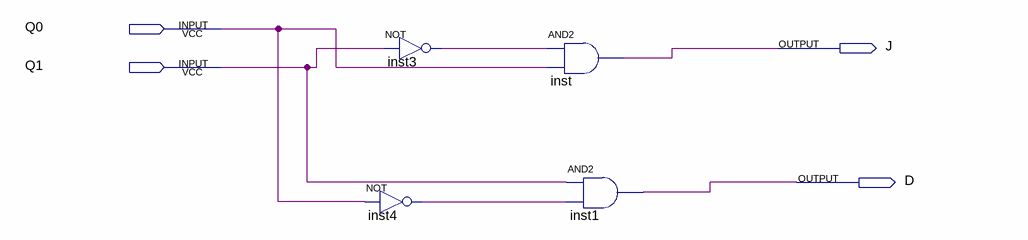
[diagram p0: schematic sheet]
// Quartus schematic decoderAcumulador.bdf as structural Verilog: 4 symbols, 4 pins
module decoderAcumulador (
  input  Q0,
  input  Q1,
  output J,
  output D
);

  wire inst3_out, inst4_out;

  not inst4 (inst4_out, Q0);
  not inst3 (inst3_out, Q1);
  and inst (J, inst3_out, Q0);
  and inst1 (D, Q1, inst4_out);
endmodule
